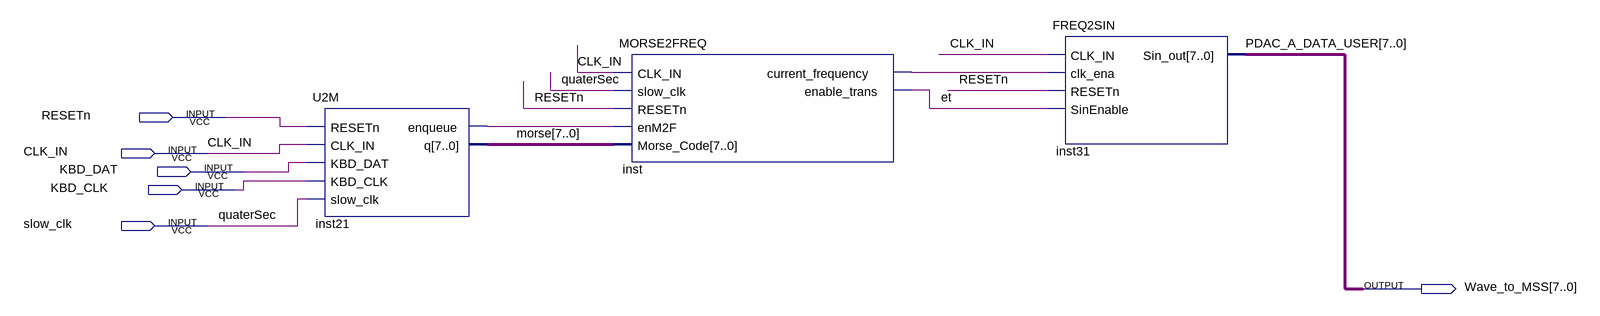
[diagram p0: schematic sheet]
// Quartus schematic Transmitter.bdf as structural Verilog: 3 symbols, 6 pins
module Transmitter (
  input  RESETn,
  input  CLK_IN,
  input  KBD_DAT,
  input  KBD_CLK,
  input  slow_clk,
  output [7:0] Wave_to_MSS
);

  wire et, inst21_enqueue, inst_current_frequency;
  wire [7:0] morse;

  U2M inst21 (
    .RESETn(RESETn), .CLK_IN(CLK_IN), .KBD_DAT(KBD_DAT), .KBD_CLK(KBD_CLK), .slow_clk(slow_clk),
    .enqueue(inst21_enqueue), .q(morse));
  MORSE2FREQ inst (
    .CLK_IN(CLK_IN), .slow_clk(slow_clk), .RESETn(RESETn), .enM2F(inst21_enqueue), .Morse_Code(morse),
    .current_frequency(inst_current_frequency), .enable_trans(et));
  FREQ2SIN inst31 (
    .CLK_IN(CLK_IN), .clk_ena(inst_current_frequency), .RESETn(RESETn), .SinEnable(et), .Sin_out(Wave_to_MSS));

  // Other names for the same wires on the sheet: PDAC_A_DATA_USER[7:0] = Wave_to_MSS; quaterSec = slow_clk
endmodule
